# EAGLE design Adafruit SEN5x Adapter Breakout (EAGLE 9.6.2)
COMPANY: ADAFRUIT INDUSTRIES; DRAWN: KTOWN; REV: A
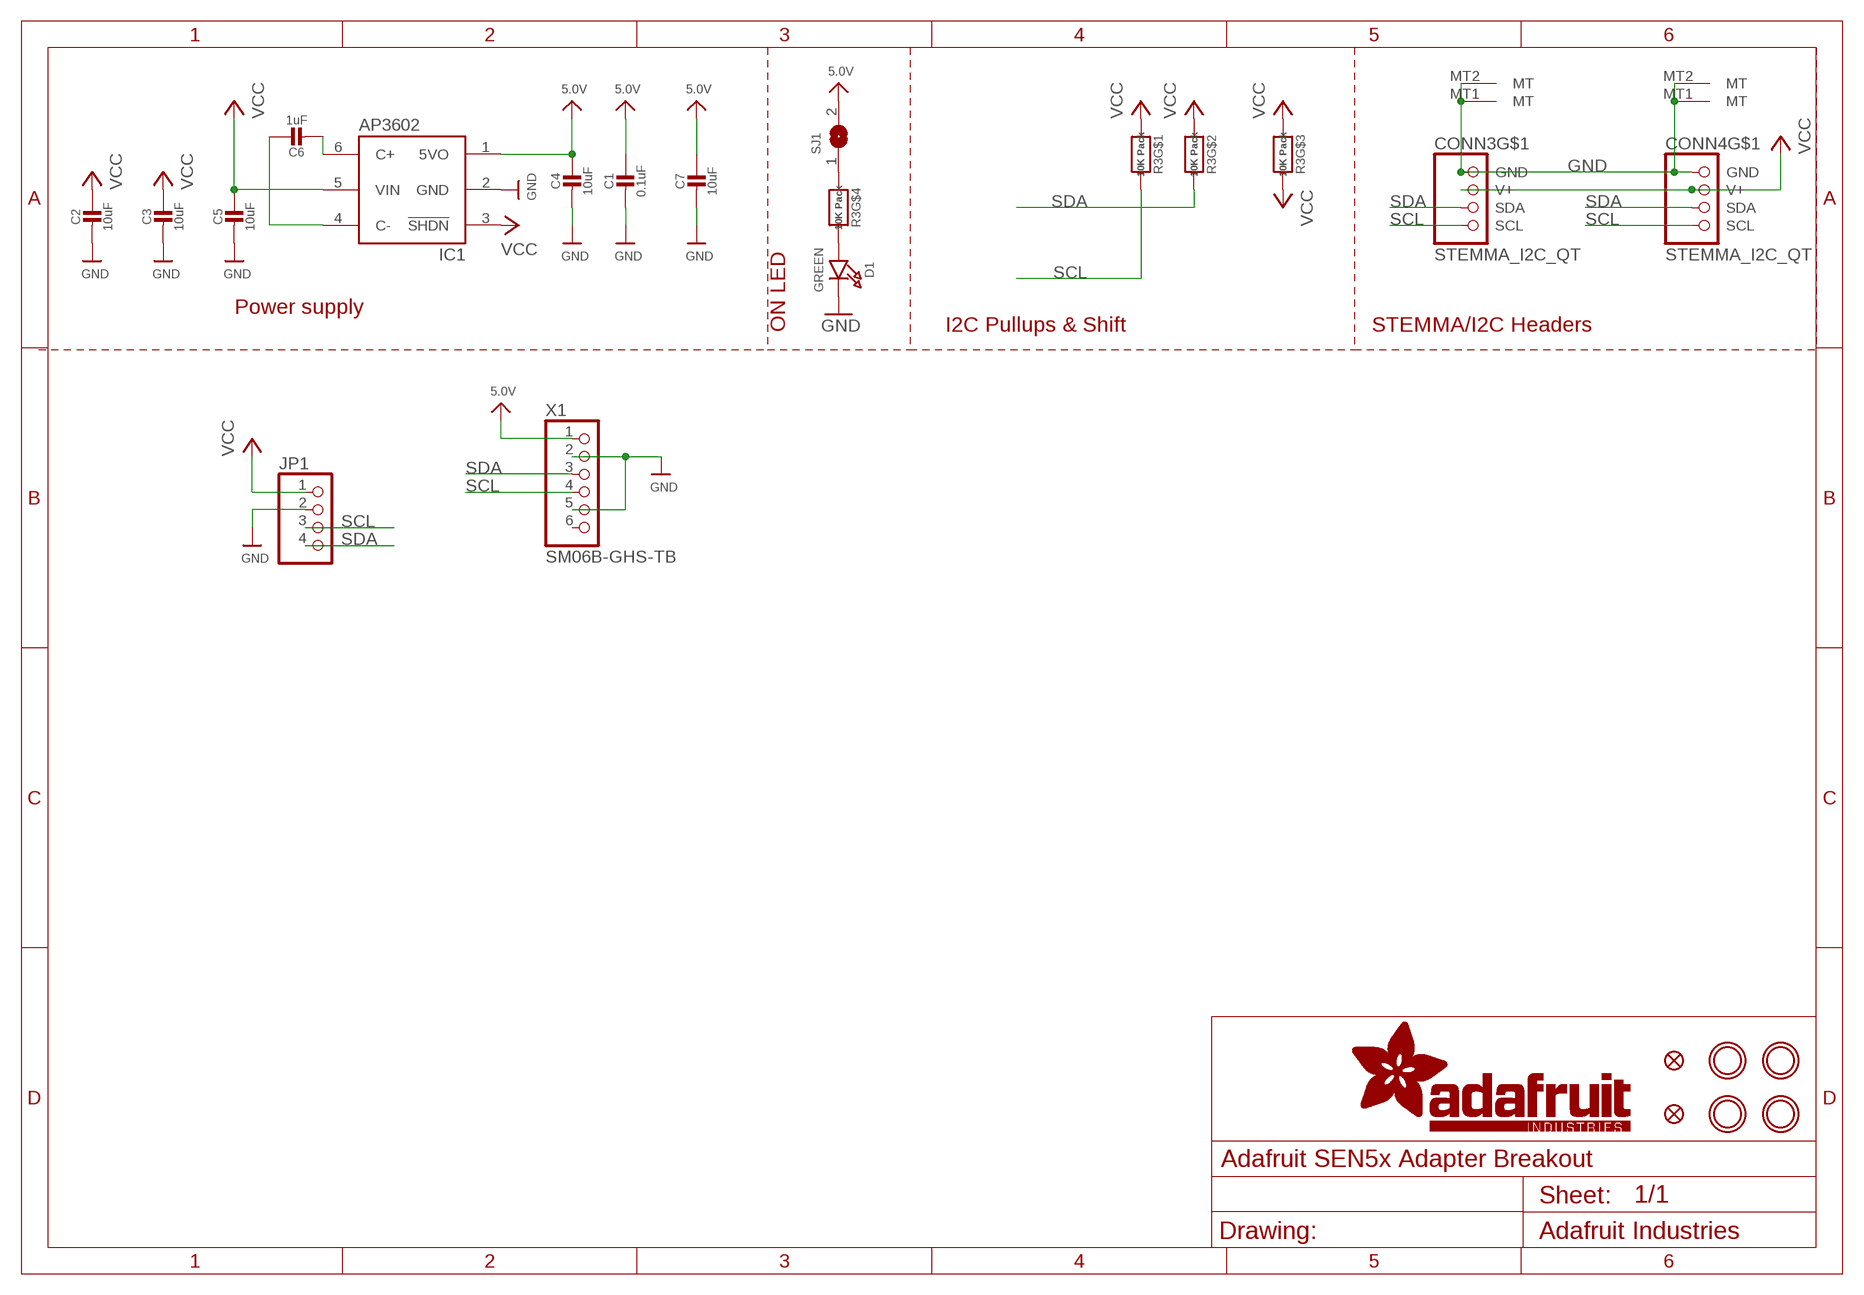
[diagram p0: schematic, sheet 1]

## Parts
C1  0.1uF  CAP_CERAMIC0603_NO  [0603-NO]
C2  10uF  CAP_CERAMIC0805-NOOUTLINE  [0805-NO]
C3  10uF  CAP_CERAMIC0805-NOOUTLINE  [0805-NO]
C4  10uF  CAP_CERAMIC0805-NOOUTLINE  [0805-NO]
C5  10uF  CAP_CERAMIC0805-NOOUTLINE  [0805-NO]
C6  1uF  CAP_CERAMIC0805-NOOUTLINE  [0805-NO]
C7  10uF  CAP_CERAMIC0805-NOOUTLINE  [0805-NO]
CONN3  STEMMA_I2C_QT  [JST_SH4]
CONN4  STEMMA_I2C_QT  [JST_SH4]
D1  GREEN  LED0603_NOOUTLINE  [CHIPLED_0603_NOOUTLINE]
FID3  FIDUCIAL_1MM  [FIDUCIAL_1MM]
FID4  FIDUCIAL_1MM  [FIDUCIAL_1MM]
IC1  AP3602/RT9361  AP3602  [SOT23-6]
JP1  HEADER-1X4ROUND  [1X04_ROUND]
R3  10K Pack  RESISTOR_4PACK  [RESPACK_4X0603]
SJ1  SOLDERJUMPERCLOSED  [SOLDERJUMPER_CLOSEDWIRE]
U$1  MOUNTINGHOLE2.5  [MOUNTINGHOLE_2.5_PLATED]
U$17  MOUNTINGHOLE2.5  [MOUNTINGHOLE_2.5_PLATED]
U$19  MOUNTINGHOLE2.5  [MOUNTINGHOLE_2.5_PLATED]
U$21  MOUNTINGHOLE2.5  [MOUNTINGHOLE_2.5_PLATED]
X1  SM06B-GHS-TB  CON_JST_PH_6PIN_SM06S_GHS  [CONN_SM06B-GHS-TB_JST]

## Nets
5.0V: C1.1 C4.1 C7.1 IC1.1(5VO) SJ1.2 X1.1
GND [highpower]: C1.2 C2.2 C3.2 C4.2 C5.2 C7.2 CONN3.1(GND) CONN3.MT1(MT) CONN3.MT2(MT) CONN4.1(GND) CONN4.MT1(MT) CONN4.MT2(MT) D1.C IC1.2(GND) JP1.2 X1.2 X1.5
N$1: D1.A R3.5
N$2: R3.4 SJ1.1
N$3: C6.2 IC1.6(C+)
N$4: C6.1 IC1.4(C-)
SCL: CONN3.4(SCL) CONN4.4(SCL) JP1.3 R3.8 X1.4
SDA: CONN3.3(SDA) CONN4.3(SDA) JP1.4 R3.7 X1.3
VCC [highpower]: C2.1 C3.1 C5.1 CONN3.2(V+) CONN4.2(V+) IC1.3(!SHDN) IC1.5(VIN) JP1.1 R3.1 R3.2 R3.3 R3.6
Unconnected: X1.6

## Notes on the sheet
- Power supply
- ON LED | I2C Pullups & Shift | STEMMA/I2C Headers

## Library data of the parts
C1-C7 = microbuilder:CAP_CERAMIC: Ceramic Capacitors For new designs, use the packages preceded by an '_' character since they are more reliable: The following footprints should be used on most boards: _0402 - Standard footprint for regular board layouts _0603 - Standard footprint for regular board layouts _0805 - Standard footprint for regular board layouts _1206 - Standard footprint for regular board layouts For extremely tight-pitch boards where space is at a premium, the following 'micro-pitch' footprints can be used (smaller pads, no silkscreen outline, etc.): _0402MP - Micro-pitch footprint for very dense/compact boards _0603MP - Micro-pitch footprint for very dense/compact boards _0805MP - Micro-pitch footprint for very dense/compact boards _1206MP - Micro-pitch footprint for very dense/compact boards
CONN3 CONN4 = adafruit_electromech:STEMMA_I2C; LCSC: C2845363
D1 = microbuilder:LED: LED 0603 - 0603 Surface Mount Package 2mA: Green LED - Low Power (3.9mcd, 2ma, 1.7Vf) - Digikey: 475-2709-2-ND Orange LED - Low Power (9.8mcd, 2ma, 1.8Vf) - Digikey: 475-1194-2-ND Red LED - Low Power (5mcd, 2ma, 1.8Vf) - Digikey: 475-1195-2-ND Yellow LED - Low Power (7mcd, 2ma, 1.8Vf) - Digikey: 475-1196-2-ND 5mA: Blue LED - Low Power (17mcd, 5ma, 2.9Vf) - Digikey: LNJ937W8CRACT-ND 0805 - 0805 Surface Mount Package 2mA: Red LED (8.8mcd, 2mA, 1.8Vf, Clear) - Low Power [Digikey: 475-2510-1-ND] Green LED (5mcd, 2mA, 1.8Vf, Clear) - Low Power [Digikey: 475-2730-1-ND] Yellow LED (11.3mcd, 2mA, 1.8Vf, Clear) - Low Power [Digikey: 475-2555-1-ND] 20mA: Red LED (104mcd, 20mA, Diffused) - LS R976 [Digikey: 475-1278-6-ND] Red LED (12mcd, 20mA, 2.0Vf, Clear) - APT2012EC [Digikey: 754-1128-1-ND] Green LED (15mcd, 20mA, 2.2Vf, Clear) - APT2012GC [Digikey: 754-1131-1-ND] Orange LED (160mcd, 20mA, 2.1Vf, Clear) - APT2012SECK [Digikey: 754-1130-1-ND] 1206 - 1206 Surface Mount Package Green LED (26mcd, 20mA, Diffused) - LG N971 [Digikey: 475-1407-6-ND] Red LED (15mcd, 20mA, Diffused) - LH N974 [Digikey: 475-1416-6-ND] Cree - Cree High-Power Surface Mount LEDs XPEBWT-L1-0000-00D50 - White 111lm 350mA 2.9Vf 6200K 110° XTEAWT-00-0000-00000LEE3 - White 114lm 350mA 2.85Vf 5000K 115° Everlight - Everlight 45-21 Series Surface Mount LEDs 45-21/QK2C-B2832AC2CB2/2T - Warm White 2000mcd 20mA 3.25Vf 3050K 120° 45-21/LK2C-B38452C4CB2/2T - Nuetral White 2000mcd 20mA 3.25Vf 4150K 120° 45-21/LK2C-B50634C6CB2/2T - Cold White 2200mcd 20mA 3.25Vf 5650K 120° PLCC2 Reverse Mount LS T77K-J1L2-1-0-2-R18-Z - Red 11.25mcd 2mA 1.8Vf 630nm 120° LO T77K-L1M2-24-Z - Orange 19.6mcd 2mA 1.8Vf 606nm 120° LY T77K-K2M1-26-Z - Yellow 15.7mcd 2mA 1.8Vf 587nm 120°; ROT: 270
FID3 FID4 = microbuilder:FIDUCIAL: Fiducial Alignment Points Various fiducial points for machine vision alignment.; BOM: EXCLUDE
IC1 = microbuilder:AP3602
JP1 = microbuilder:HEADER-1X4: PIN HEADER
R3 = microbuilder:RESISTOR_4PACK: Resistor Packs (4 resistors) 4 x 0603 10K 1/16W - Digikey: YC164J-10KCT-ND
SJ1 = microbuilder:SOLDERJUMPER: SMD Solder JUMPER Solder the two pads together to create a connection, or remove the solder to break it. REFLOW - Use this footprint for solder paste and reflow ovens. WAVE - Use this footprint for hand-soldering (larger pads). CLOSED - Has a trace between the two pads to ensure it is closed by default. The trace needs to be cut to disable the jumper, and can be closed again by creating a solder bridge between the two pads.
U$1 U$17 U$19 U$21 = adafruit_electromech:MOUNTINGHOLE: Mounting Hole For #2 screws (0.086"/2.18mm width, 0.094"/2.4mm hole) use 2.5mm; BOM: EXCLUDE
X1 = adafruit_electromech:CON_JST_PH_6PIN: JST 6-Pin Right-Angle Connector

## Net classes
1 highpower: width 0.305 mm, drill 0.483 mm
2 lowpower: width 0.254 mm, drill 0.483 mm

## Board
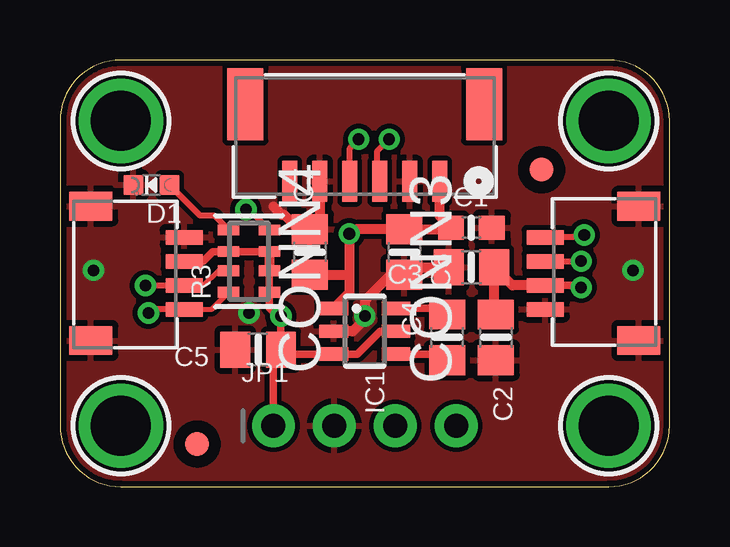
[diagram p1: board, top side]
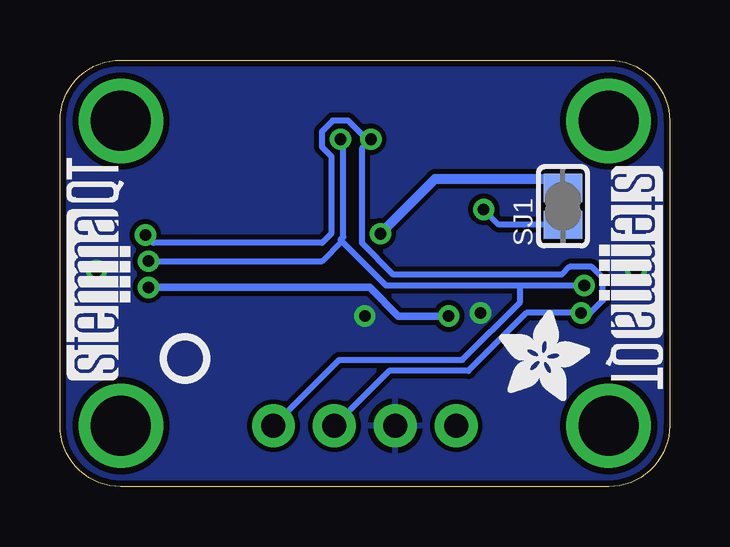
[diagram p2: board, bottom side, seen from below]

Size 25.4 x 17.78 mm. Coordinates in mm from the lower left corner, seen from the top.
Outline: 25.4,2.54 25.4,15.24 arc90 22.86,17.78 2.54,17.78 arc90 0,15.24 0,2.54 arc90 2.54,0 22.86,0 arc90 25.4,2.54
Copper layers (1*16): Top 0.035mm / dielectric 1.5mm / Bottom 0.035mm
Design rules "adafruit *": minimum track width 8mil, minimum drill 15.5mil, track to track 8mil, track to pad 8mil, pad to pad 8mil, via to via 8mil, smd to smd 8mil, copper to edge 10mil, drill to drill 8mil, minimum pad ring 10mil, minimum via ring 8mil, stop-mask expansion 2mil, vias tented up to drill 20mil, thermal gap 10mil

### Footprints (pad centres in the part's own frame; a part is rotated, then mirrored left to right if it is on the bottom)
0603-NO = smd 1.075 x 1: 1 -0.85,0; 2 0.85,0
0805-NO = smd 1.24 x 1.5: 1 -0.95,0; 2 0.95,0
JST_SH4 = smd 0.6 x 1.55: 1 -1.5,2.006; 2 -0.5,2.006; 3 0.5,2.006; 4 1.5,2.006 | smd 1.2 x 1.8: MT1 -2.8,-1.894; MT2 2.8,-1.894
CHIPLED_0603_NOOUTLINE = smd 0.8 x 0.8: A 0,-0.75; C 0,0.75
FIDUCIAL_1MM = smd 1 x 1: 1 0,0
SOT23-6 = smd 0.55 x 1.2: 1 -0.95,-1.3; 2 0,-1.3; 3 0.95,-1.3; 4 0.95,1.3; 5 0,1.3; 6 -0.95,1.3
1X04_ROUND = drill 1 pad 1.778: 1 -3.81,0; 2 -1.27,0; 3 1.27,0; 4 3.81,0
RESPACK_4X0603 = smd 0.45 x 0.9: 1 -1.3,-0.85; 2 -0.4,-0.85; 3 0.4,-0.85; 4 1.3,-0.85; 5 1.3,0.85; 6 0.4,0.85; 7 -0.4,0.85; 8 -1.3,0.85
SOLDERJUMPER_CLOSEDWIRE = smd 1.168 x 1.6: 1 -0.762,0; 2 0.762,0 | smd 0.635 x 0.203: WIRE 0,0
MOUNTINGHOLE_2.5_PLATED = drill 2.5 pad 3.2: P$1 0,0
CONN_SM06B-GHS-TB_JST = smd 0.61 x 1.702: 1 -3.125,1.876; 2 -1.875,1.876; 3 -0.625,1.876; 4 0.625,1.876; 5 1.875,1.876; 6 3.125,1.876 | smd 1.5 x 3: 7 -4.975,-1.324; 8 4.975,-1.324

### Placement (x,y rotation side)
C1  17.14,10.79 0 top
C2  18.16,6.22 270 top
C3  17.14,9.14 180 top
C4  14.35,9.78 270 top
C5  8.26,5.71 180 top
C6  16.13,6.22 90 top
C7  10.41,9.78 90 top
CONN3  22.23,8.89 90 top
CONN4  3.17,8.89 270 top
D1  3.81,12.57 90 top
FID3  5.71,1.78 180 top
FID4  20.07,13.21 180 top
IC1  12.7,6.48 270 top
JP1  12.7,2.54 0 top
PLABEL5  [PLABEL5]  0.38,12.45 0 top
PLABEL13  [PLABEL13]  5.59,14.22 0 bottom
PLABEL14  [PLABEL14]  6.48,13.59 90 top
PLABEL15  [PLABEL15]  20.19,15.11 90 top
PLABEL16  [PLABEL16]  9.02,4.19 0 top
PLABEL17  [PLABEL17]  11.56,0.89 0 top
PLABEL18  [PLABEL18]  14.1,4.19 0 top
PLABEL19  [PLABEL19]  16.64,0.89 0 top
PLABEL20  [PLABEL20]  12.7,8.89 0 bottom
PLABEL21  [PLABEL21]  12.83,16.51 0 bottom
R3  7.87,9.4 90 top
SJ1  4.45,11.68 90 bottom
U$1  22.86,2.54 180 top
U$15  [ADAFRUIT_3.5MM]  7.11,3.56 0 bottom
U$17  2.54,2.54 180 top
U$19  22.86,15.24 180 top
U$21  2.54,15.24 180 top
U$25  [PCBFEAT-REV-040]  20.19,5.33 180 bottom
U$30  [STEMMAQT]  2.92,13.34 270 bottom
U$31  [STEMMAQT]  22.48,4.45 90 bottom
X1  12.7,14.61 180 top

### Tracks (layer width: path | path; a pad name or v marks a point on that pad's centre or on a via)
5.0V  (via drill 0.48)
  Top 0.305: 11.5,7.52 IC1.1
  Top 0.406: 12.05,8.89 v12.05,10.54 12.19,10.54 12.38,10.73 C4.1 16.23,10.73 C1.1 15.82,11.27 X1.1 | 12.05,8.89 12.05,8.08 11.5,7.52 | C7.1 11.99,8.83 12.05,8.89
  Bottom 0.406: SJ1.2 4.83,12.83 9.77,12.83 v12.05,10.54
GND  (via drill 0.48)
  Top 0.406: IC1.2 12.19,6.48 12.7,6.99 12.7,7.75 13.78,8.83 C4.2 14.67,9.14 C3.2 | X1.5 10.82,11.14 C7.2 9.94,10.73 9.34,11.33 9.24,11.33 8.89,11.68
  other vias: 1.4,9.02 23.88,9.02 7.87,7.24 12.7,7.11
  pour Top: 25.4,0 0,0 0,17.78 25.4,17.78
  pour Bottom: 25.4,0 0,0 0,17.78 25.4,17.78
N$1
  Top 0.254: D1.A 5.83,11.3 6.42,11.3 R3.5
N$2  (via drill 0.48)
  Top 0.254: R3.4 7.87,11.56 v7.75,11.56
  Bottom 0.254: v7.75,11.56 7.11,10.92 SJ1.1
N$3
  Top 0.305: IC1.6 15.88,7.43 C6.2
N$4
  Top 0.305: IC1.4 15.88,5.53 C6.1
SCL  (via drill 0.48)
  Top 0.203: CONN4.4 6.32,7.39 R3.8
  Top 0.254: X1.4 12.07,14.11 v12.45,14.48 | v21.84,10.49 21.74,10.39 CONN3.4 | CONN4.4 3.83,7.39 v3.68,7.24
  Bottom 0.254: v21.84,10.49 21.51,10.16 14.48,10.16 14.1,10.54 14.1,13.76 14.49,14.16 14.49,14.8 14.04,15.25 13.39,15.25 12.62,14.48 v12.45,14.48 12.83,14.1 12.83,10.16 11.51,8.84 4.5,8.84 4.18,9.16 3.23,9.16 2.78,8.7 2.78,7.76 3.3,7.24 v3.68,7.24 5.97,7.24 8.38,4.83 11.68,4.83 JP1.3
SDA  (via drill 0.48)
  Top 0.203: CONN4.3 5.98,8.39 6.58,9 R3.7
  Top 0.254: CONN3.3 v21.72,9.4 | v13.72,14.48 13.21,13.97 13.21,12.85 X1.3 | CONN4.3 v3.56,8.38
  Bottom 0.254: v21.72,9.4 14.48,9.4 13.65,10.22 | v13.72,14.48 13.59,14.35 13.59,10.41 13.72,10.29 13.65,10.22 | v3.56,8.38 6.22,8.38 | 6.22,8.38 11.81,8.38 13.65,10.22 | JP1.4 13.77,5.28 8.64,5.28 6.22,7.7 6.22,8.38
VCC  (via drill 0.48)
  Top 0.305: R3.2 R3.1 8.72,7.46 9.07,7.11 v9.21,7.11 C5.1 | C5.1 9.39,5.53 IC1.3 12.38,5.53 13.34,6.48 IC1.5 | JP1.1 8.89,5.4 C5.1 | CONN4.2 5.96,9.39 6.37,9.8 R3.6 R3.3 | CONN3.2 21.63,8.39 v21.72,8.31
  Top 0.406: R3.3 R3.2 | C2.1 18.09,7.24 C3.1 18.85,8.39 CONN3.2
  Bottom 0.305: v21.72,8.31 12.5,8.31 11.3,7.11 v9.21,7.11

### Text on the board
Pinguin_tBackup: 5DL | 5CL | G | 5V | VIN | 5x | SEN | 5V logic level | on | Vin | 3-5V logic level | SCL | VIN | 5V | GND | G | 3CL | SDA | 3DA
Pinguin_bBackup: Vin/Vlogic: 3-5VDC | Stemma QT/Breadboard / 5V Boost + Level Shifter / 3-5V in, 5V@100mA Out | SEN-54/55 / I2C QT Power / Adapter | LED